# Altium schematic sheet microcontroller interface.SchDoc
size A4; Author: Azmat Bilal; Organization: Shamrock Green; Revision: 1.0.0; SheetNumber: 1; SheetTotal: 4
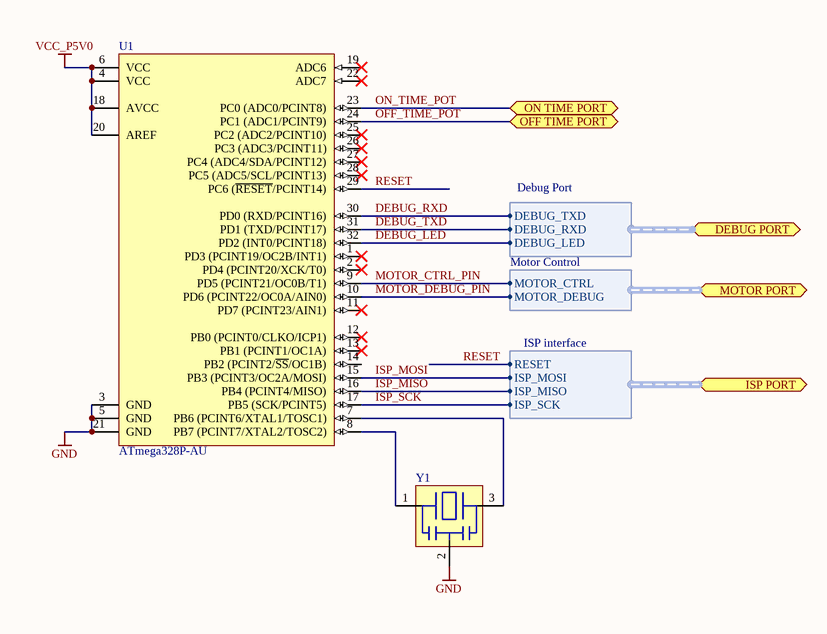
[diagram p0: microcontroller interface.SchDoc]

## Parts
U1  ATmega328P-AU  [32A_N]
Y1  CSTCE16M0V53  [CSTCE_V_C]  (value not drawn)

## Ports
DEBUG PORT (harness Debug Port), ISP PORT (harness ISP interface), MOTOR PORT (harness Motor Control), OFF TIME PORT, ON TIME PORT

## Harnesses
Debug Port: DEBUG_TXD, DEBUG_RXD, DEBUG_LED
ISP interface: RESET, ISP_MOSI, ISP_MISO, ISP_SCK
Motor Control: MOTOR_CTRL, MOTOR_DEBUG

## Nets
GND: U1.3(GND) U1.5(GND) U1.21(GND) Y1.2
VCC_P5V0: U1.4(VCC) U1.6(VCC) U1.18(AVCC) U1.20(AREF)
DEBUG_LED: U1.32(PD2_(INT0/PCINT18)) ; port DEBUG PORT.DEBUG_LED
DEBUG_RXD: U1.30(PD0_(RXD/PCINT16)) ; port DEBUG PORT.DEBUG_TXD
DEBUG_TXD: U1.31(PD1_(TXD/PCINT17)) ; port DEBUG PORT.DEBUG_RXD
ISP_MISO: U1.16(PB4_(PCINT4/MISO)) ; port ISP PORT.ISP_MISO
ISP_MOSI: U1.15(PB3_(PCINT3/OC2A/MOSI)) ; port ISP PORT.ISP_MOSI
ISP_SCK: U1.17(PB5_(SCK/PCINT5)) ; port ISP PORT.ISP_SCK
MOTOR_CTRL_PIN: U1.9(PD5_(PCINT21/OC0B/T1)) ; port MOTOR PORT.MOTOR_CTRL
MOTOR_DEBUG_PIN: U1.10(PD6_(PCINT22/OC0A/AIN0)) ; port MOTOR PORT.MOTOR_DEBUG
OFF_TIME_POT: U1.24(PC1_(ADC1/PCINT9)) ; port OFF TIME PORT
ON_TIME_POT: U1.23(PC0_(ADC0/PCINT8)) ; port ON TIME PORT
RESET: U1.29(PC6_(~{RESET}/PCINT14)) ; port ISP PORT.RESET
NetU1_7: U1.7(PB6_(PCINT6/XTAL1/TOSC1)) Y1.3
NetU1_8: U1.8(PB7_(PCINT7/XTAL2/TOSC2)) Y1.1

Not connected (* = marked no-connect by the designer): U1 1(PD3_(PCINT19/OC2B/INT1))* 2(PD4_(PCINT20/XCK/T0))* 11(PD7_(PCINT23/AIN1))* 12(PB0_(PCINT0/CLKO/ICP1))* 13(PB1_(PCINT1/OC1A))* 14(PB2_(PCINT2/~{SS}/OC1B)) 19(ADC6)* 22(ADC7)* 25(PC2_(ADC2/PCINT10))* 26(PC3_(ADC3/PCINT11))* 27(PC4_(ADC4/SDA/PCINT12))* 28(PC5_(ADC5/SCL/PCINT13))*

## Notes on the sheet
- Project:
- Auther:
- Sheet
- of
- Shamrock Green
- Date:
- Revision:
- Time:

## Library data of the parts
U1 = ATmega328P-AU: 8-bit AVR Microcontroller, 32KB Flash, 1KB EEPROM, 2KB SRAM, 32-pin TQFP, Industrial Grade (-40°C to 85°C); Published: 1-Apr-2010; DatasheetVersion: revA, Jan-2010; PackageVersion: revB, Oct-2001; PackageReference: 32A; Publisher: Altium Limited; PackageDescription: 32-Lead, 7x7x1.0 mm Body, 0.8mm Lead Pitch, Thin Profile Plastic Quad Flat Package (TQFP); Supplier 1: Digi-Key; Supplier Part Number 1: ATMEGA328P-AU-ND; Supplier 2: Farnell; Supplier Part Number 2: 1715486; Supplier 3: Mouser; Supplier Part Number 3: 556-ATMEGA328P-AU; Code_JEDEC: MS-026-ABA; ComponentLink1Description: Manufacturer Link; ComponentLink1URL: http://www.atmel.com/products/avr/default.asp?; ComponentLink2Description: ATmega48A/48PA/88A/88PA/168A/168PA/328/328P Datasheet; ComponentLink2URL: http://www.atmel.com/dyn/resources/prod_documents/8271.pdf; ComponentLink3Description: ATmega48A/48PA/88A/88PA/168A/168PA/328/328P Summary; ComponentLink3URL: http://www.atmel.com/dyn/resources/prod_documents/8271S.pdf; ComponentLink4Description: Atmel.com Home; ComponentLink4URL: http://www.atmel.com
Y1 = CSTCE16M0V53: Ceremic Resonator, 16 MHz, Built-in capacitance 15pF, SMT, 5% tolerance; datasheet: http://www.murata.com/products/catalog/pdf/p16e.pdf